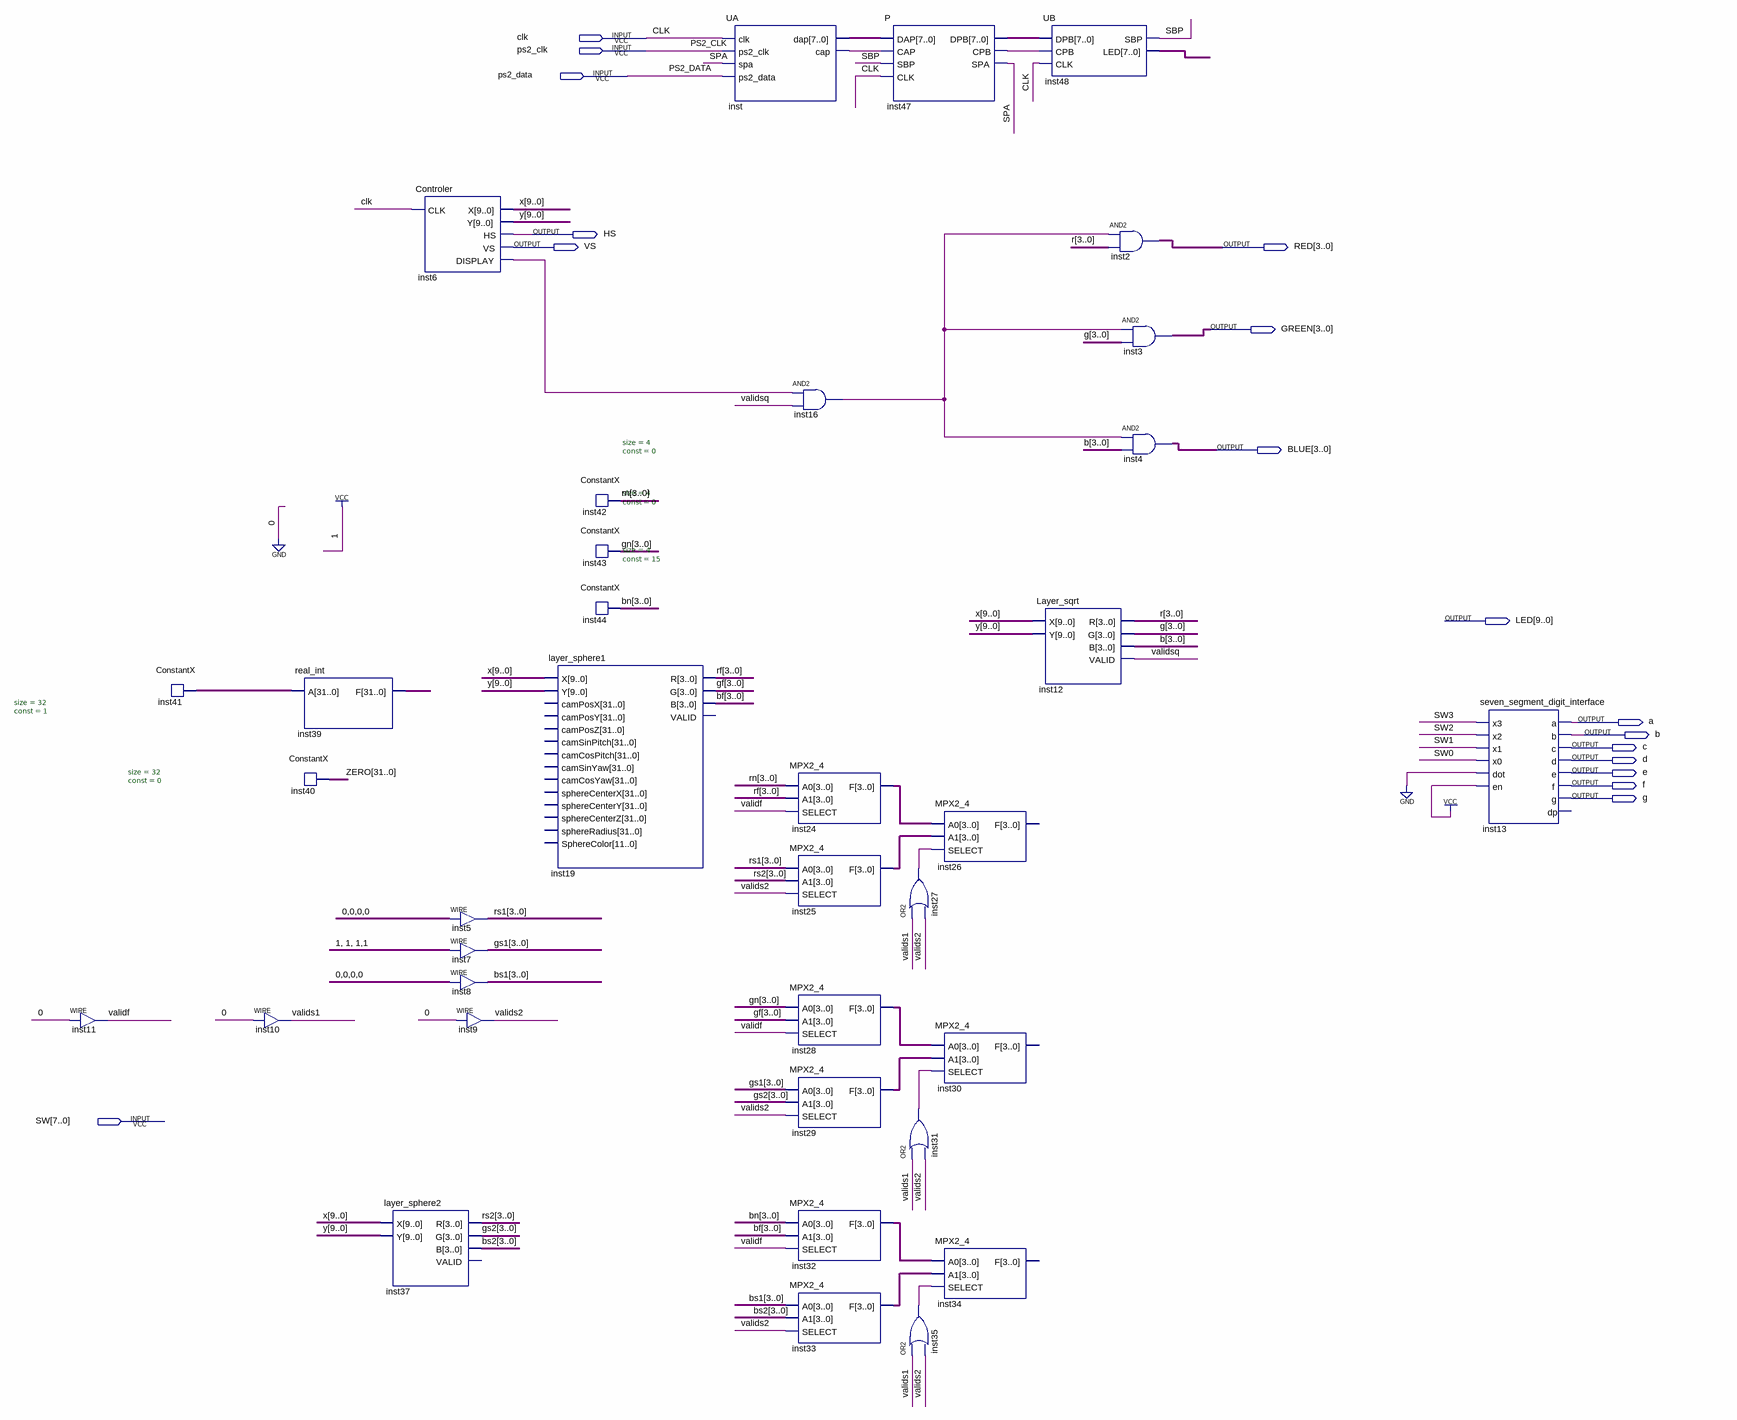
[diagram p0: schematic sheet]
// Quartus schematic prethodna_verzija.bdf as structural Verilog: 36 symbols, 17 pins
module prethodna_verzija (
  input  clk,
  input  ps2_clk,
  input  ps2_data,
  input  [7:0] SW,
  output HS,
  output VS,
  output [3:0] RED,
  output [3:0] GREEN,
  output [3:0] BLUE,
  output [9:0] LED,
  output a,
  output b,
  output c,
  output d,
  output e,
  output f,
  output g
);

  wire inst6_display, inst16_out, inst27_out, inst31_out, inst35_out, inst47_cpb, inst_cap, SBP, SPA, validf,
       valids1, valids2, validsq;
  wire [3:0] b_bus, bf, bn, bs1, bs2, g_bus, gf, gn, gs1, gs2, inst24_f, inst25_f, inst28_f, inst29_f,
       inst32_f, inst33_f, r, rf, rn, rs1, rs2;
  wire [7:0] inst47_dpb, inst48_led, inst_dap;
  wire [9:0] x, y;
  wire [31:0] inst39_f, inst41_data_out, ZERO;

  assign validf = 1'b0;  // WIRE inst11
  ConstantX #(.size(32), .\const (1)) inst41 (.DATA_OUT(inst41_data_out));
  assign valids1 = 1'b0;  // WIRE inst10
  real_int inst39 (.A(inst41_data_out), .F(inst39_f));
  ConstantX #(.size(32), .\const (0)) inst40 (.DATA_OUT(ZERO));
  layer_sphere2 inst37 (.X(x), .Y(y), .R(rs2), .G(gs2), .B(bs2));  // open: VALID
  Controler inst6 (.CLK(clk), .X(x), .Y(y), .HS(HS), .VS(VS), .DISPLAY(inst6_display));
  assign rs1 = 4'b0000;  // WIRE inst5
  assign gs1 = 4'b1111;  // WIRE inst7
  assign bs1 = 4'b0000;  // WIRE inst8
  assign valids2 = 1'b0;  // WIRE inst9
  ConstantX #(.size(4), .\const (0)) inst42 (.DATA_OUT(rn));
  ConstantX #(.size(4), .\const (0)) inst43 (.DATA_OUT(gn));
  ConstantX #(.size(4), .\const (15)) inst44 (.DATA_OUT(bn));
  layer_sphere1 inst19 (
    .X(x), .Y(y), .R(rf), .G(gf), .B(bf));  // open: camPosX, camPosY, camPosZ, camSinPitch, camCosPitch, camSinYaw, camCosYaw, sphereCenterX, sphereCenterY, sphereCenterZ, sphereRadius, SphereColor, VALID
  UA inst (.clk(clk), .ps2_clk(ps2_clk), .spa(SPA), .ps2_data(ps2_data), .dap(inst_dap), .cap(inst_cap));
  MPX2_4 inst24 (.A0(rn), .A1(rf), .SELECT(validf), .F(inst24_f));
  MPX2_4 inst25 (.A0(rs1), .A1(rs2), .SELECT(valids2), .F(inst25_f));
  MPX2_4 inst28 (.A0(gn), .A1(gf), .SELECT(validf), .F(inst28_f));
  MPX2_4 inst29 (.A0(gs1), .A1(gs2), .SELECT(valids2), .F(inst29_f));
  MPX2_4 inst32 (.A0(bn), .A1(bf), .SELECT(validf), .F(inst32_f));
  MPX2_4 inst33 (.A0(bs1), .A1(bs2), .SELECT(valids2), .F(inst33_f));
  and inst16 (inst16_out, inst6_display, validsq);
  P inst47 (.DAP(inst_dap), .CAP(inst_cap), .SBP(SBP), .CLK(clk), .DPB(inst47_dpb), .CPB(inst47_cpb), .SPA(SPA));
  MPX2_4 inst26 (.A0(inst24_f), .A1(inst25_f), .SELECT(inst27_out));  // open: F
  or inst27 (inst27_out, valids1, valids2);
  MPX2_4 inst30 (.A0(inst28_f), .A1(inst29_f), .SELECT(inst31_out));  // open: F
  or inst31 (inst31_out, valids1, valids2);
  MPX2_4 inst34 (.A0(inst32_f), .A1(inst33_f), .SELECT(inst35_out));  // open: F
  or inst35 (inst35_out, valids1, valids2);
  UB inst48 (.DPB(inst47_dpb), .CPB(inst47_cpb), .CLK(clk), .SBP(SBP), .LED(inst48_led));
  Layer_sqrt inst12 (.X(x), .Y(y), .R(r), .G(g_bus), .B(b_bus), .VALID(validsq));
  assign RED = {4{inst16_out}} & r;  // AND2 inst2, 4 bits wide
  assign GREEN = {4{inst16_out}} & g_bus;  // AND2 inst3, 4 bits wide
  assign BLUE = {4{inst16_out}} & b_bus;  // AND2 inst4, 4 bits wide
  seven_segment_digit_interface inst13 (
    .x3(SW[3]), .x2(SW[2]), .x1(SW[1]), .x0(SW[0]), .dot(1'b0), .en(1'b1), .a(a), .b(b), .c(c), .d(d), .e(e),
    .f(f), .g(g));  // open: dp
endmodule
